# Altium project eZ80F92-Z20X.PrjPcb
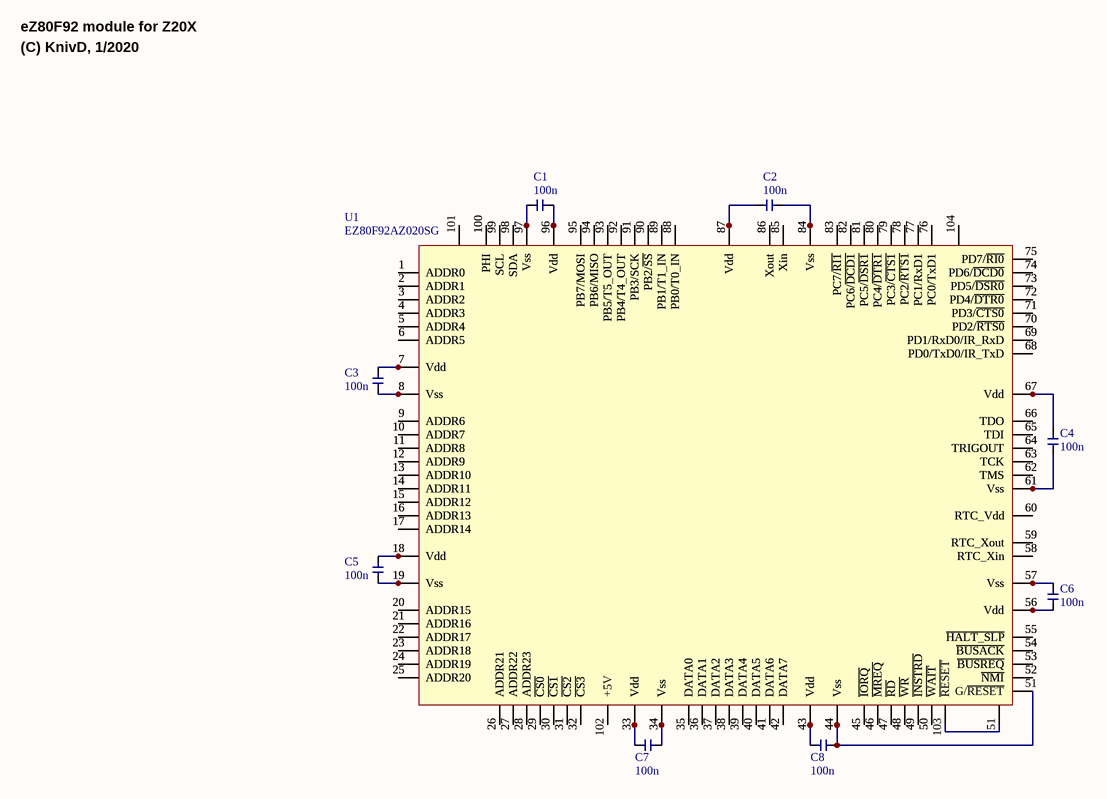
[diagram p0: main.SchDoc]
1 sheet, 10 parts. Net scope: global (net labels, ports and power ports of the same name join across sheets).
Board file: PCB.PcbDoc

## Sheet main.SchDoc: ELLO TROLL
size A4; Author: KnivD; DrawnBy: KnivD; Engineer: KnivD; DocumentNumber: 1; Revision: 1704; SheetNumber: 1; SheetTotal: 1; ProjectName: ELLO TROLL

### Parts
C1  100n  [_0805_CAP]
C2  100n  [_0805_CAP]
C3  100n  [_0805_CAP]
C4  100n  [_0805_CAP]
C5  100n  [_0805_CAP]
C6  100n  [_0805_CAP]
C7  100n  [_0805_CAP]
C8  100n  [_0805_CAP]
MOD1  Z20X CPU Module  [PGA100X15]  (value not drawn)
U1  EZ80F92AZ020SG  [QFP50P1600X1600X170-100N]

### Nets
NetC1_1: C1.1 MOD1.96(Vdd) U1.96(Vdd)
NetC1_2: C1.2 MOD1.97(Vss) U1.97(Vss)
NetC2_1: C2.1 MOD1.84(Vss) U1.84(Vss)
NetC2_2: C2.2 MOD1.87(Vdd) U1.87(Vdd)
NetC3_1: C3.1 MOD1.7(Vdd) U1.7(Vdd)
NetC3_2: C3.2 MOD1.8(Vss) U1.8(Vss)
NetC4_1: C4.1 MOD1.61(Vss) U1.61(Vss)
NetC4_2: C4.2 MOD1.67(Vdd) U1.67(Vdd)
NetC5_1: C5.1 MOD1.18(Vdd) U1.18(Vdd)
NetC5_2: C5.2 MOD1.19(Vss) U1.19(Vss)
NetC6_1: C6.1 MOD1.56(Vdd) U1.56(Vdd)
NetC6_2: C6.2 MOD1.57(Vss) U1.57(Vss)
NetC7_1: C7.1 MOD1.33(Vdd) U1.33(Vdd)
NetC7_2: C7.2 MOD1.34(Vss) U1.34(Vss)
NetC8_1: C8.1 MOD1.43(Vdd) U1.43(Vdd)
NetC8_2: C8.2 MOD1.44(Vss) MOD1.51(G/~{RESET}) U1.44(Vss)
NetMOD1_1: MOD1.1(ADDR0) U1.1(ADDR0)
NetMOD1_2: MOD1.2(ADDR1) U1.2(ADDR1)
NetMOD1_3: MOD1.3(ADDR2) U1.3(ADDR2)
NetMOD1_4: MOD1.4(ADDR3) U1.4(ADDR3)
NetMOD1_5: MOD1.5(ADDR4) U1.5(ADDR4)
NetMOD1_6: MOD1.6(ADDR5) U1.6(ADDR5)
NetMOD1_9: MOD1.9(ADDR6) U1.9(ADDR6)
NetMOD1_10: MOD1.10(ADDR7) U1.10(ADDR7)
NetMOD1_11: MOD1.11(ADDR8) U1.11(ADDR8)
NetMOD1_12: MOD1.12(ADDR9) U1.12(ADDR9)
NetMOD1_13: MOD1.13(ADDR10) U1.13(ADDR10)
NetMOD1_14: MOD1.14(ADDR11) U1.14(ADDR11)
NetMOD1_15: MOD1.15(ADDR12) U1.15(ADDR12)
NetMOD1_16: MOD1.16(ADDR13) U1.16(ADDR13)
NetMOD1_17: MOD1.17(ADDR14) U1.17(ADDR14)
NetMOD1_20: MOD1.20(ADDR15) U1.20(ADDR15)
NetMOD1_21: MOD1.21(ADDR16) U1.21(ADDR16)
NetMOD1_22: MOD1.22(ADDR17) U1.22(ADDR17)
NetMOD1_23: MOD1.23(ADDR18) U1.23(ADDR18)
NetMOD1_24: MOD1.24(ADDR19) U1.24(ADDR19)
NetMOD1_25: MOD1.25(ADDR20) U1.25(ADDR20)
NetMOD1_26: MOD1.26(ADDR21) U1.26(ADDR21)
NetMOD1_27: MOD1.27(ADDR22) U1.27(ADDR22)
NetMOD1_28: MOD1.28(ADDR23) U1.28(ADDR23)
NetMOD1_29: MOD1.29(~{CS0}) U1.29(~{CS0})
NetMOD1_30: MOD1.30(~{CS1}) U1.30(~{CS1})
NetMOD1_31: MOD1.31(~{CS2}) U1.31(~{CS2})
NetMOD1_32: MOD1.32(~{CS3}) U1.32(~{CS3})
NetMOD1_35: MOD1.35(DATA0) U1.35(DATA0)
NetMOD1_36: MOD1.36(DATA1) U1.36(DATA1)
NetMOD1_37: MOD1.37(DATA2) U1.37(DATA2)
NetMOD1_38: MOD1.38(DATA3) U1.38(DATA3)
NetMOD1_39: MOD1.39(DATA4) U1.39(DATA4)
NetMOD1_40: MOD1.40(DATA5) U1.40(DATA5)
NetMOD1_41: MOD1.41(DATA6) U1.41(DATA6)
NetMOD1_42: MOD1.42(DATA7) U1.42(DATA7)
NetMOD1_45: MOD1.45(~{IORQ}) U1.45(~{IORQ})
NetMOD1_46: MOD1.46(~{MREQ}) U1.46(~{MREQ})
NetMOD1_47: MOD1.47(~{RD}) U1.47(~{RD})
NetMOD1_48: MOD1.48(~{WR}) U1.48(~{WR})
NetMOD1_49: MOD1.49(~{INSTRD}) U1.49(~{INSTRD})
NetMOD1_50: MOD1.50(~{WAIT}) U1.50(~{WAIT})
NetMOD1_52: MOD1.52(~{NMI}) U1.52(~{NMI})
NetMOD1_53: MOD1.53(~{BUSREQ}) U1.53(~{BUSREQ})
NetMOD1_54: MOD1.54(~{BUSACK}) U1.54(~{BUSACK})
NetMOD1_55: MOD1.55(~{HALT_SLP}) U1.55(~{HALT_SLP})
NetMOD1_58: MOD1.58(RTC_Xin) U1.58(RTC_Xin)
NetMOD1_59: MOD1.59(RTC_Xout) U1.59(RTC_Xout)
NetMOD1_60: MOD1.60(RTC_Vdd) U1.60(RTC_Vdd)
NetMOD1_62: MOD1.62(TMS) U1.62(TMS)
NetMOD1_63: MOD1.63(TCK) U1.63(TCK)
NetMOD1_64: MOD1.64(TRIGOUT) U1.64(TRIGOUT)
NetMOD1_65: MOD1.65(TDI) U1.65(TDI)
NetMOD1_66: MOD1.66(TDO) U1.66(TDO)
NetMOD1_68: MOD1.68(PD0/TxD0/IR_TxD) U1.68(PD0/TxD0/IR_TxD)
NetMOD1_69: MOD1.69(PD1/RxD0/IR_RxD) U1.69(PD1/RxD0/IR_RxD)
NetMOD1_70: MOD1.70(PD2/~{RTS0}) U1.70(PD2/~{RTS0})
NetMOD1_71: MOD1.71(PD3/~{CTS0}) U1.71(PD3/~{CTS0})
NetMOD1_72: MOD1.72(PD4/~{DTR0}) U1.72(PD4/~{DTR0})
NetMOD1_73: MOD1.73(PD5/~{DSR0}) U1.73(PD5/~{DSR0})
NetMOD1_74: MOD1.74(PD6/~{DCD0}) U1.74(PD6/~{DCD0})
NetMOD1_75: MOD1.75(PD7/~{RI0}) U1.75(PD7/~{RI0})
NetMOD1_76: MOD1.76(PC0/TxD1) U1.76(PC0/TxD1)
NetMOD1_77: MOD1.77(PC1/RxD1) U1.77(PC1/RxD1)
NetMOD1_78: MOD1.78(PC2/~{RTS1}) U1.78(PC2/~{RTS1})
NetMOD1_79: MOD1.79(PC3/~{CTS1}) U1.79(PC3/~{CTS1})
NetMOD1_80: MOD1.80(PC4/~{DTR1}) U1.80(PC4/~{DTR1})
NetMOD1_81: MOD1.81(PC5/~{DSR1}) U1.81(PC5/~{DSR1})
NetMOD1_82: MOD1.82(PC6/~{DCD1}) U1.82(PC6/~{DCD1})
NetMOD1_83: MOD1.83(PC7/~{RI1}) U1.83(PC7/~{RI1})
NetMOD1_85: MOD1.85(Xin) U1.85(Xin)
NetMOD1_86: MOD1.86(Xout) U1.86(Xout)
NetMOD1_88: MOD1.88(PB0/T0_IN) U1.88(PB0/T0_IN)
NetMOD1_89: MOD1.89(PB1/T1_IN) U1.89(PB1/T1_IN)
NetMOD1_90: MOD1.90(PB2/~{SS}) U1.90(PB2/~{SS})
NetMOD1_91: MOD1.91(PB3/SCK) U1.91(PB3/SCK)
NetMOD1_92: MOD1.92(PB4/T4_OUT) U1.92(PB4/T4_OUT)
NetMOD1_93: MOD1.93(PB5/T5_OUT) U1.93(PB5/T5_OUT)
NetMOD1_94: MOD1.94(PB6/MISO) U1.94(PB6/MISO)
NetMOD1_95: MOD1.95(PB7/MOSI) U1.95(PB7/MOSI)
NetMOD1_98: MOD1.98(SDA) U1.98(SDA)
NetMOD1_99: MOD1.99(SCL) U1.99(SCL)
NetMOD1_100: MOD1.100(PHI) U1.100(PHI)
NetMOD1_103: MOD1.103(~{RESET}) U1.51(~{RESET})

Not connected (* = marked no-connect by the designer): MOD1 101 102(+5V) 104

### Notes on the sheet
- eZ80F92 module for Z20X
- (C) KnivD, 1/2020

### Library data of the parts
C1-C8 = Capacitor
U1 = eZ80F92/93: eZ80Acclaim!® Flash Microcontrollers; Manufacturer: Zilog; Variant: 80F92 (128K Flash, 8K RAM); 80F93 (64K Flash, 4K RAM)